# EAGLE design ads-b (EAGLE 7.5.0)
PROJECT_NAME: ADS-B Receiver; REVISION: 0.1

## Sheet 1 of 4
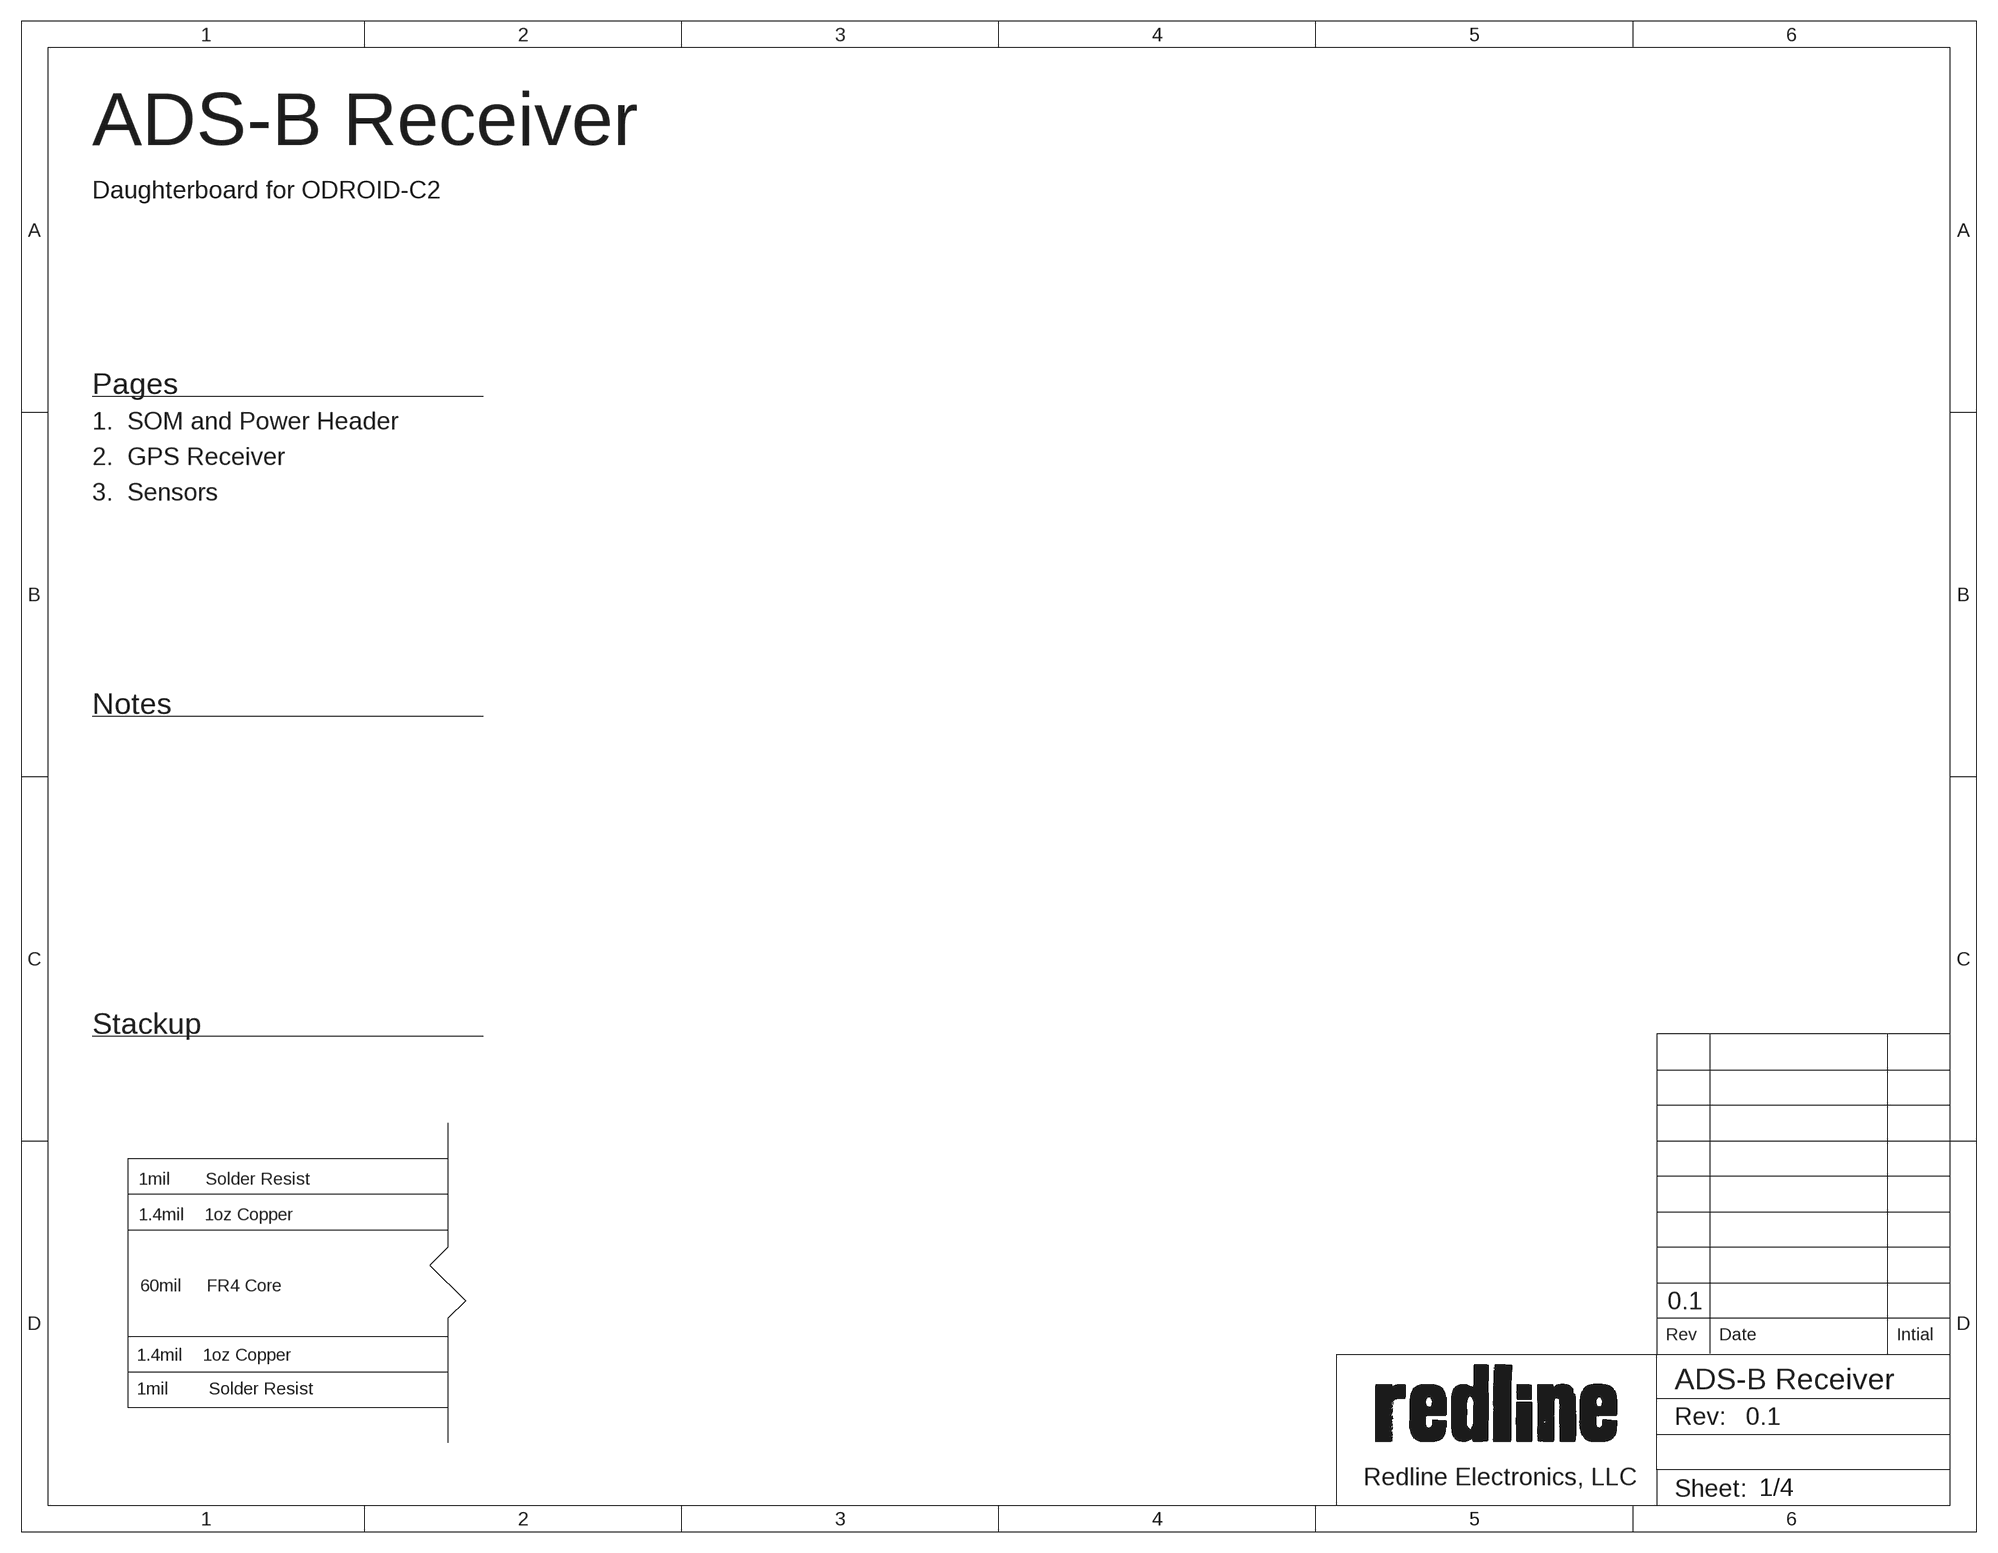
[diagram p0: schematic, sheet 1]

### Notes on the sheet
- ADS-B Receiver
- Daughterboard for ODROID-C2
- Pages
- 1.  SOM and Power Header
- 2.  GPS Receiver
- 3.  Sensors
- Notes
- Stackup
- 1mil       Solder Resist
- 1.4mil    1oz Copper
- 60mil     FR4 Core
- 0.1
- 1.4mil    1oz Copper
- 1mil        Solder Resist

## Sheet 2 of 4
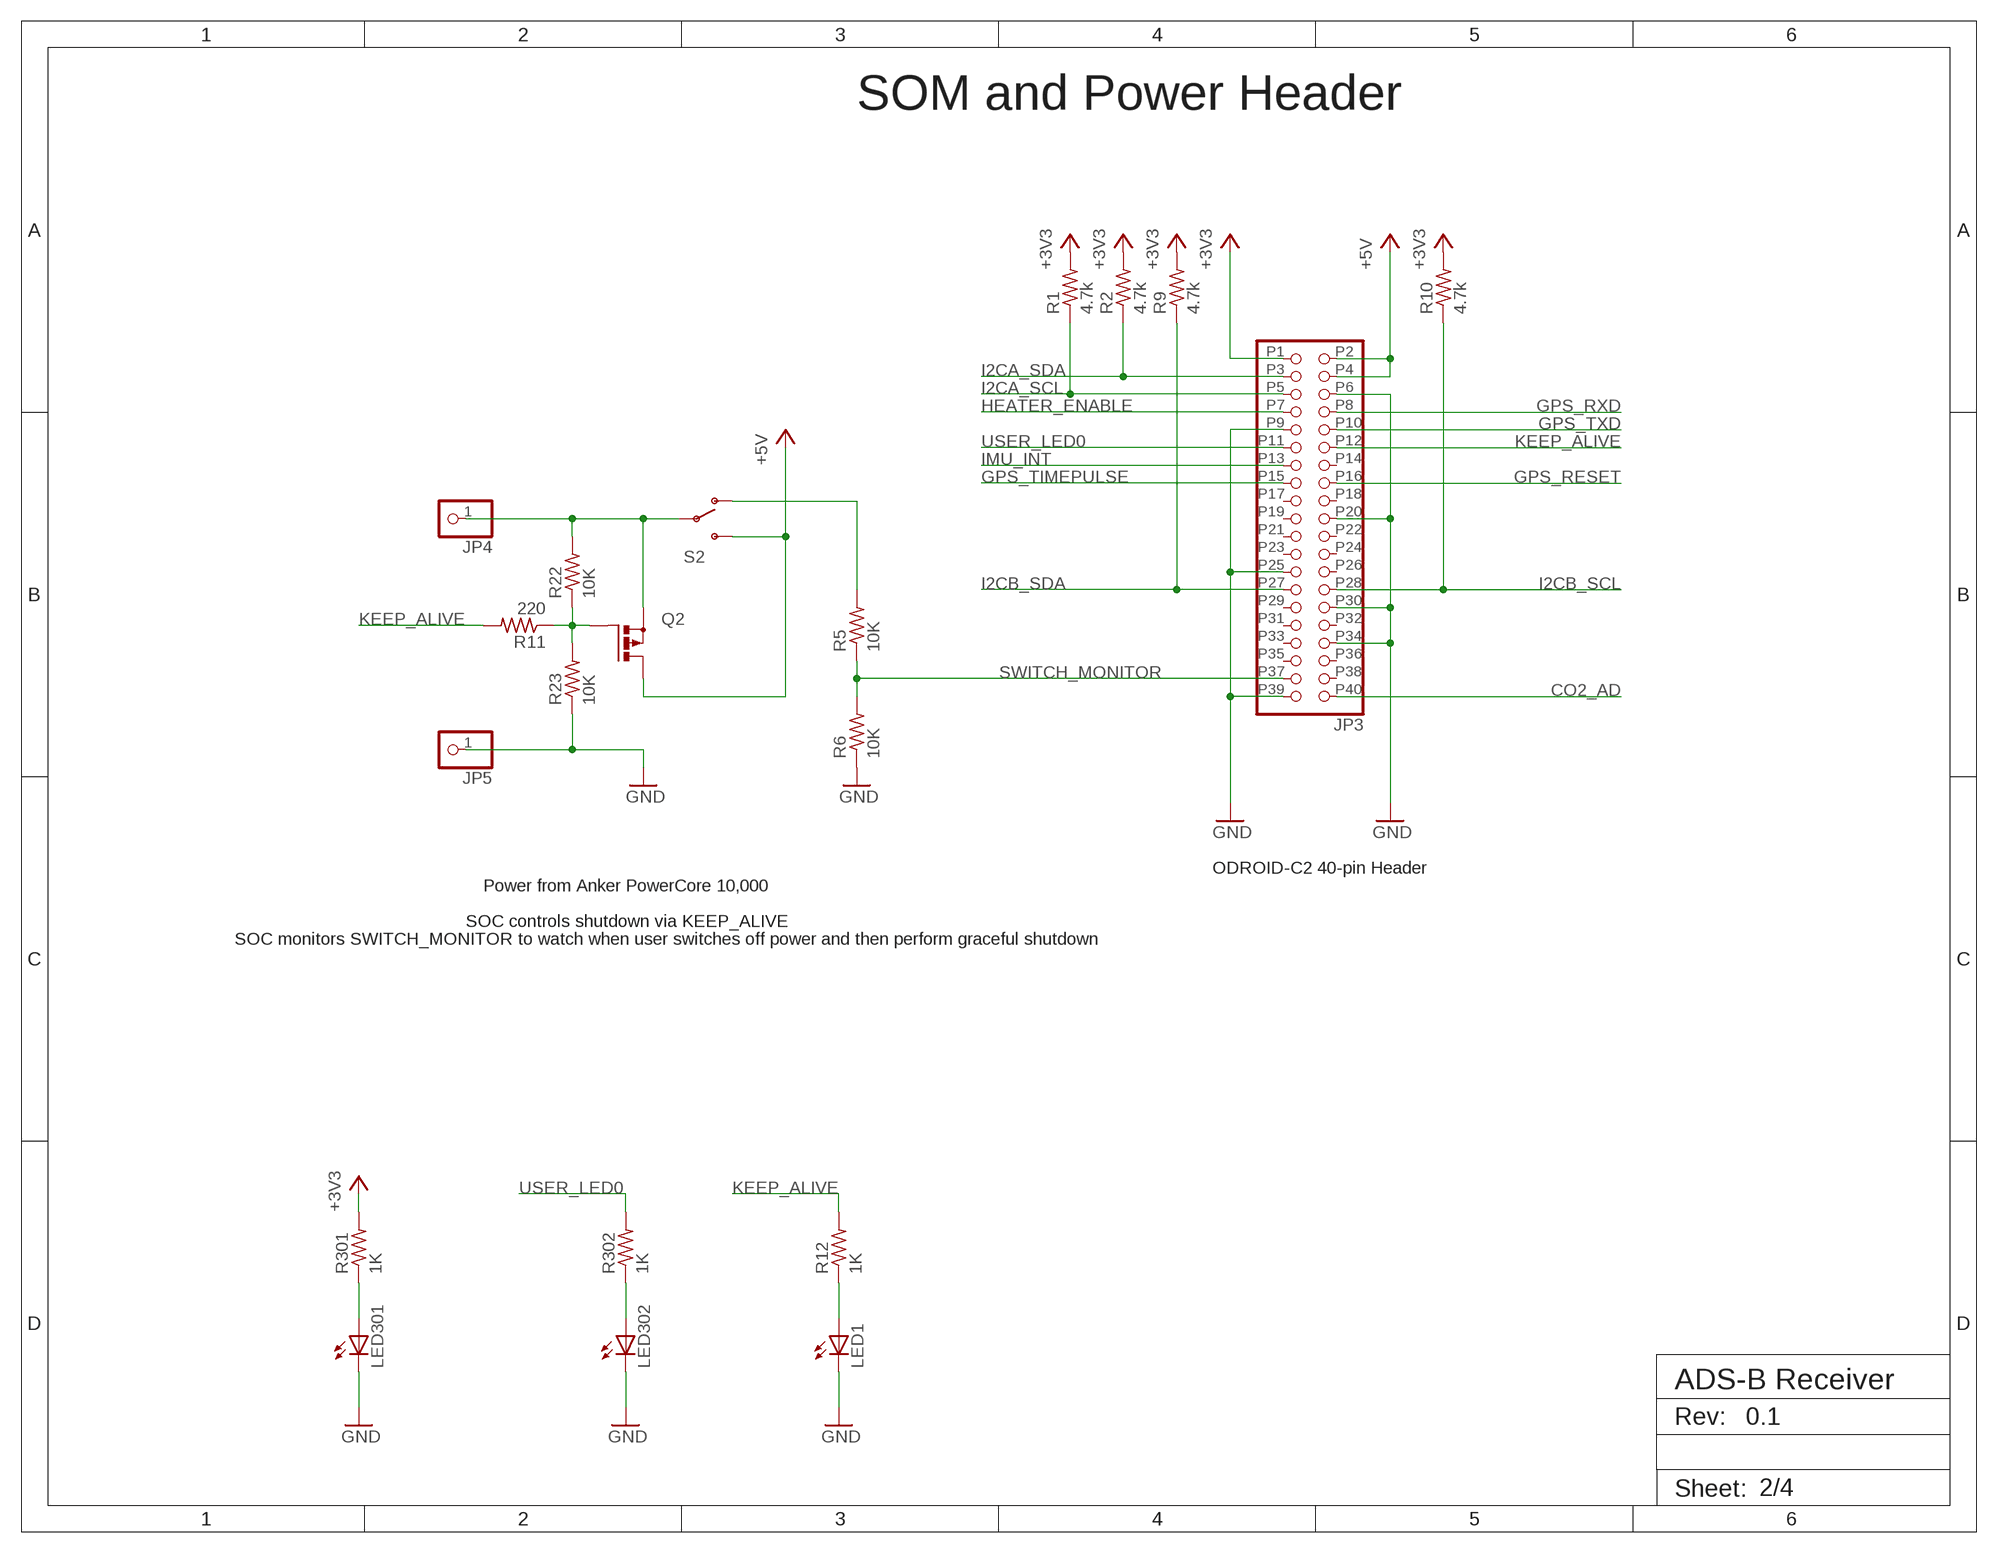
[diagram p1: schematic, sheet 2]

### Parts
JP3  ODROID-C2  [2X20]
JP4  PINHD-1X1  [1X01]
JP5  PINHD-1X1  [1X01]
LED1  LEDSML0603  [SML0603]
LED301  LEDSML0603  [SML0603]
LED302  LEDSML0603  [SML0603]
Q2  P-MOSFET-SO8  [SO-08]
R1  4.7k  R-US_R0603  [R0603]
R2  4.7k  R-US_R0603  [R0603]
R5  10K  R-US_R0603  [R0603]
R6  10K  R-US_R0603  [R0603]
R9  4.7k  R-US_R0603  [R0603]
R10  4.7k  R-US_R0603  [R0603]
R11  220  R-US_R0603  [R0603]
R12  1K  R-US_R0603  [R0603]
R22  10K  R-US_R0603  [R0603]
R23  10K  R-US_R0603  [R0603]
R301  1K  R-US_R0603  [R0603]
R302  1K  R-US_R0603  [R0603]
S2  SWITCH-SPDTSMD2  [SWITCH-SPDT-SMD]

### Nets
+3V3: JP3.P1 R1.2 R2.2 R9.2 R10.2 R301.2 ; also sheet 3,4
+5V: JP3.P2 JP3.P4 Q2.5(D) Q2.6(D) Q2.7(D) Q2.8(D) S2.3(S) ; also sheet 4
CO2_AD: JP3.P40 ; also sheet 4
GND: JP3.P6 JP3.P9 JP3.P20 JP3.P25 JP3.P30 JP3.P34 JP3.P39 JP5.1 LED1.C LED301.C LED302.C R6.1 R23.1 ; also sheet 3,4
GPS_RESET: JP3.P16 ; also sheet 3
GPS_RXD: JP3.P8 ; also sheet 3
GPS_TIMEPULSE: JP3.P15 ; also sheet 3
GPS_TXD: JP3.P10 ; also sheet 3
HEATER_ENABLE: JP3.P7 ; also sheet 4
I2CA_SCL: JP3.P5 R1.1 ; also sheet 4
I2CA_SDA: JP3.P3 R2.1 ; also sheet 4
I2CB_SCL: JP3.P28 R10.1 ; also sheet 4
I2CB_SDA: JP3.P27 R9.1 ; also sheet 4
IMU_INT: JP3.P13 ; also sheet 4
KEEP_ALIVE: JP3.P12 R11.2 R12.2
N$7: JP4.1 Q2.1(S) Q2.2(S) Q2.3(S) R22.2 S2.2(P)
N$9: Q2.4(G) R11.1 R22.1 R23.2
N$10: R5.2 S2.1(O)
SWITCH_MONITOR: JP3.P37 R5.1 R6.2
USER_LED0: JP3.P11 R302.2
VDD_PGOOD1: LED301.A R301.1
VDD_PGOOD2: LED302.A R302.1
VDD_PGOOD3: LED1.A R12.1
Unconnected: JP3.P14 JP3.P17 JP3.P18 JP3.P19 JP3.P21 JP3.P22 JP3.P23 JP3.P24 JP3.P26 JP3.P29 JP3.P31 JP3.P32 JP3.P33 JP3.P35 JP3.P36 JP3.P38

### Notes on the sheet
- SOM and Power Header
- ODROID-C2 40-pin Header
- Power from Anker PowerCore 10,000
- SOC controls shutdown via KEEP_ALIVE
- SOC monitors SWITCH_MONITOR to watch when user switches off power and then perform graceful shutdown

## Sheet 3 of 4
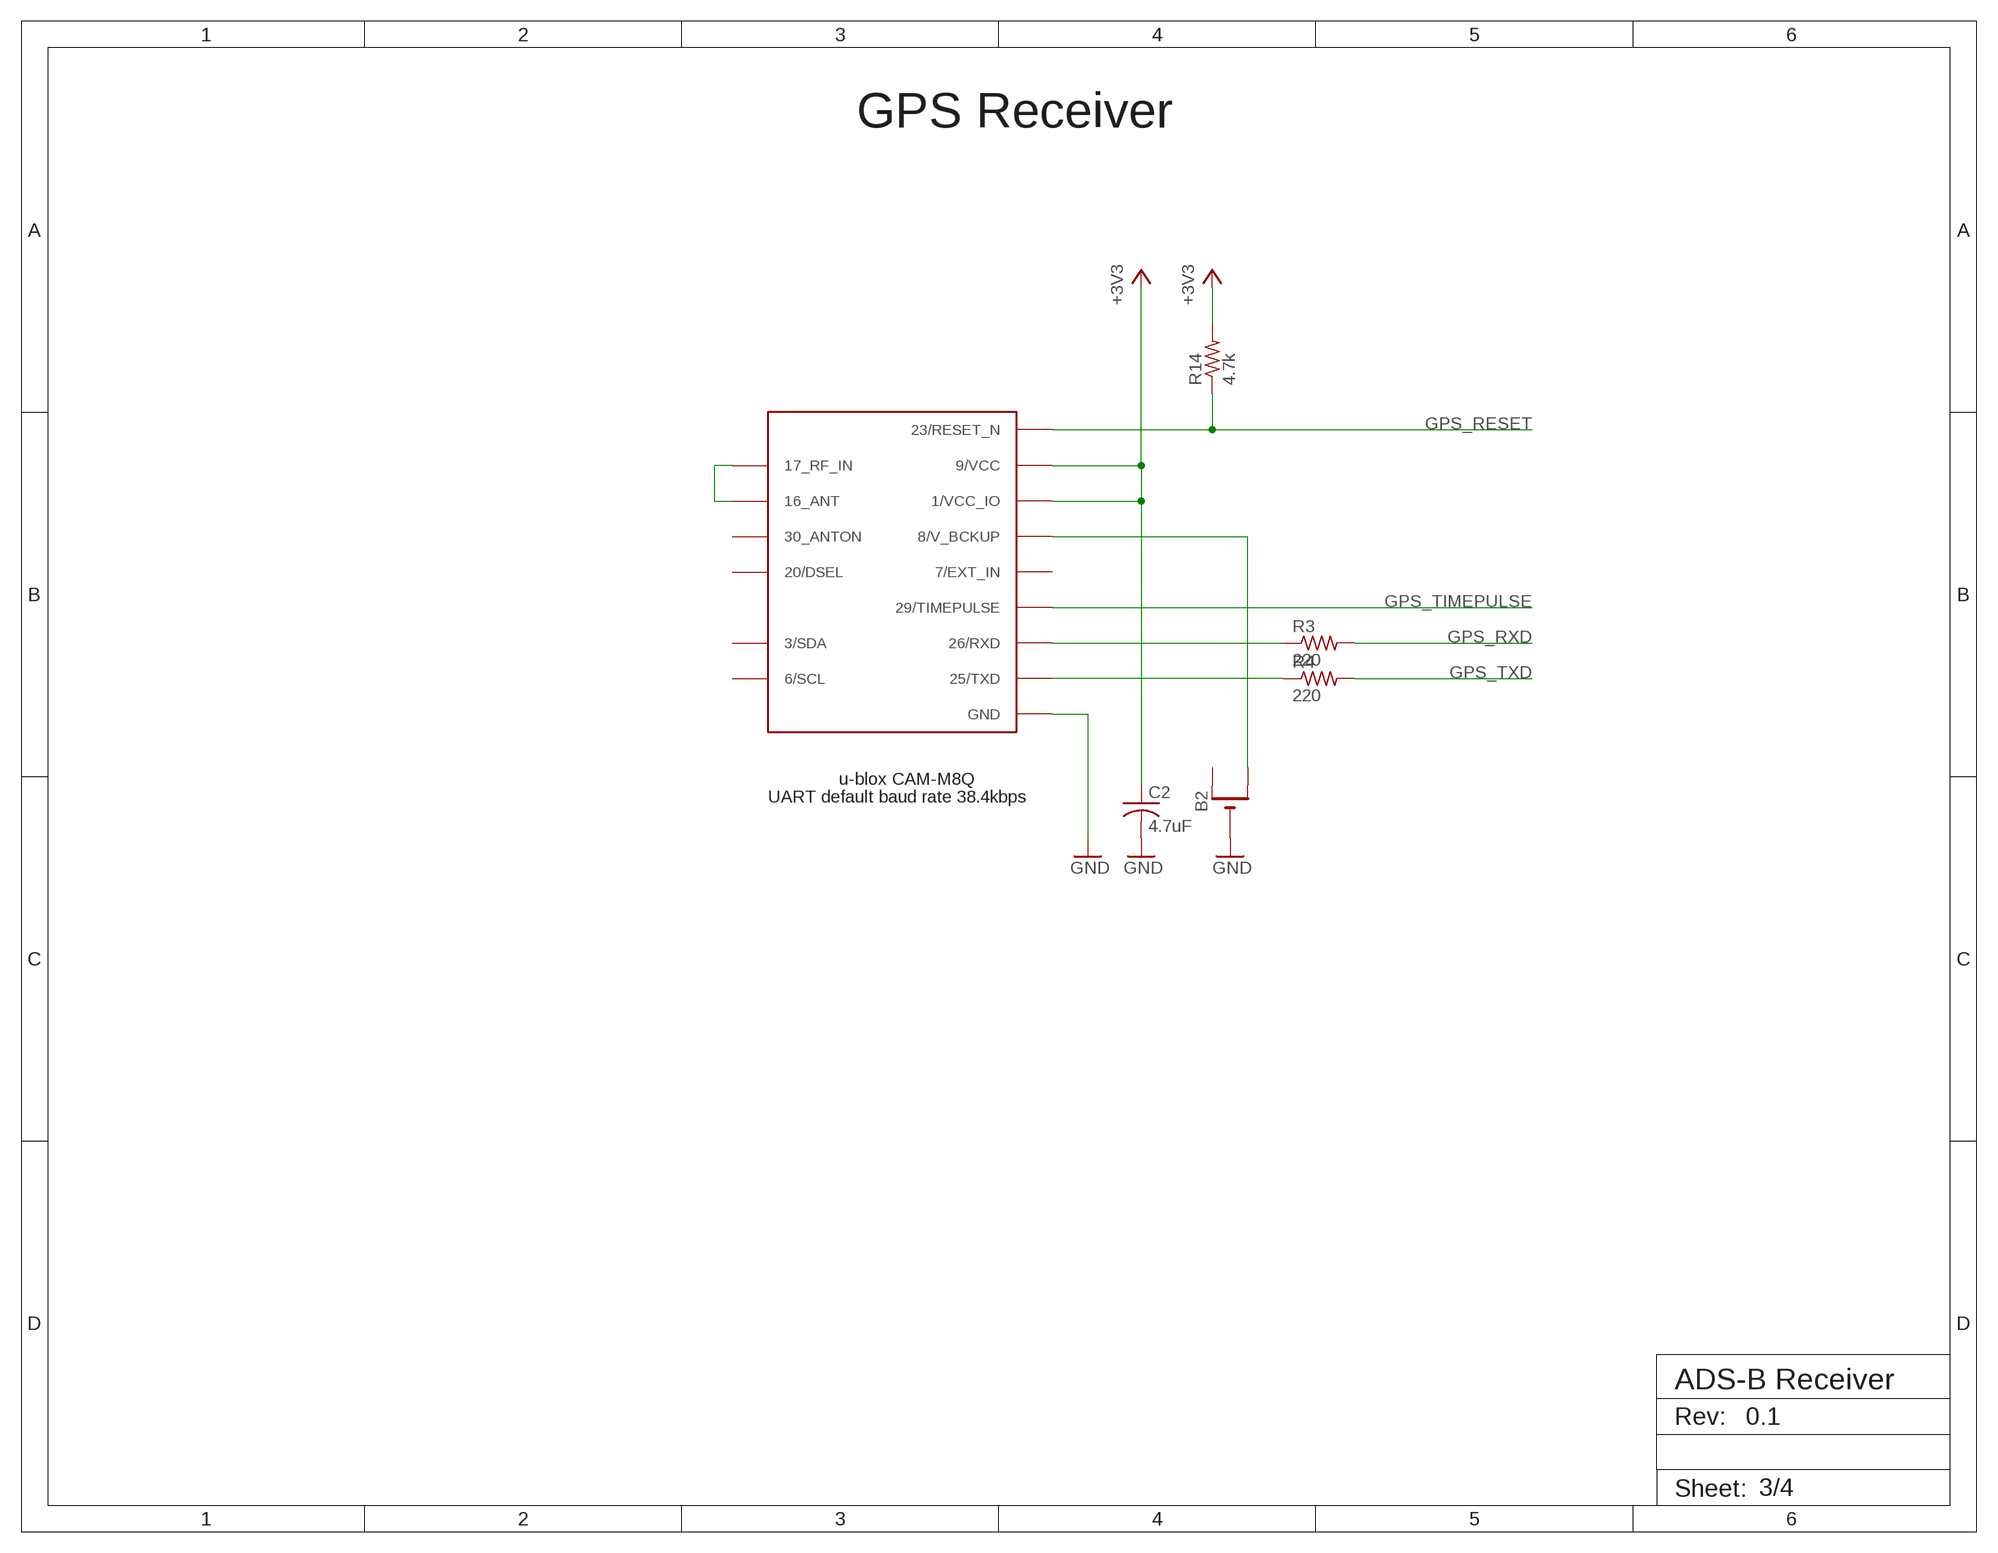
[diagram p2: schematic, sheet 3]

### Parts
B2  CR1220THM  [CR1220-THM]
C2  4.7uF  C-USC0603  [C0603]
R3  220  R-US_R0603  [R0603]
R4  220  R-US_R0603  [R0603]
R14  4.7k  R-US_R0603  [R0603]
U$2  UBLOX_CAM  [UBLOX_CAM]

### Nets
+3V3: C2.1 R14.2 U$2.1/VCC_IO U$2.9/VCC ; also sheet 2,4
GND: B2.- C2.2 U$2.4/GND(GND) U$2.5/GND(GND) U$2.10/GND(GND) U$2.11/GND(GND) U$2.12/GND(GND) U$2.13/GND(GND) U$2.14/GND(GND) U$2.15/GND(GND) U$2.18/GND(GND) U$2.19/GND(GND) U$2.21/GND(GND) U$2.22/GND(GND) U$2.27/GND(GND) U$2.31/GND(GND) ; also sheet 2,4
GPS_RESET: R14.1 U$2.23/RESET_N ; also sheet 2
GPS_RXD: R3.2 ; also sheet 2
GPS_TIMEPULSE: U$2.29/TIMEPULSE ; also sheet 2
GPS_TXD: R4.2 ; also sheet 2
N$2: B2.+2(+1) U$2.8/V_BCKP(8/V_BCKUP)
N$3: R3.1 U$2.26/RXD
N$4: R4.1 U$2.25/TXD
N$6: U$2.16/ANT(16_ANT) U$2.17/RF_IN(17_RF_IN)
Unconnected: B2.+1(+) U$2.3/SDA U$2.6/SCL U$2.7/EXINT(7/EXT_IN) U$2.20/DSEL U$2.30/ANTON(30_ANTON)

### Notes on the sheet
- GPS Receiver
- u-blox CAM-M8Q
- UART default baud rate 38.4kbps

## Sheet 4 of 4
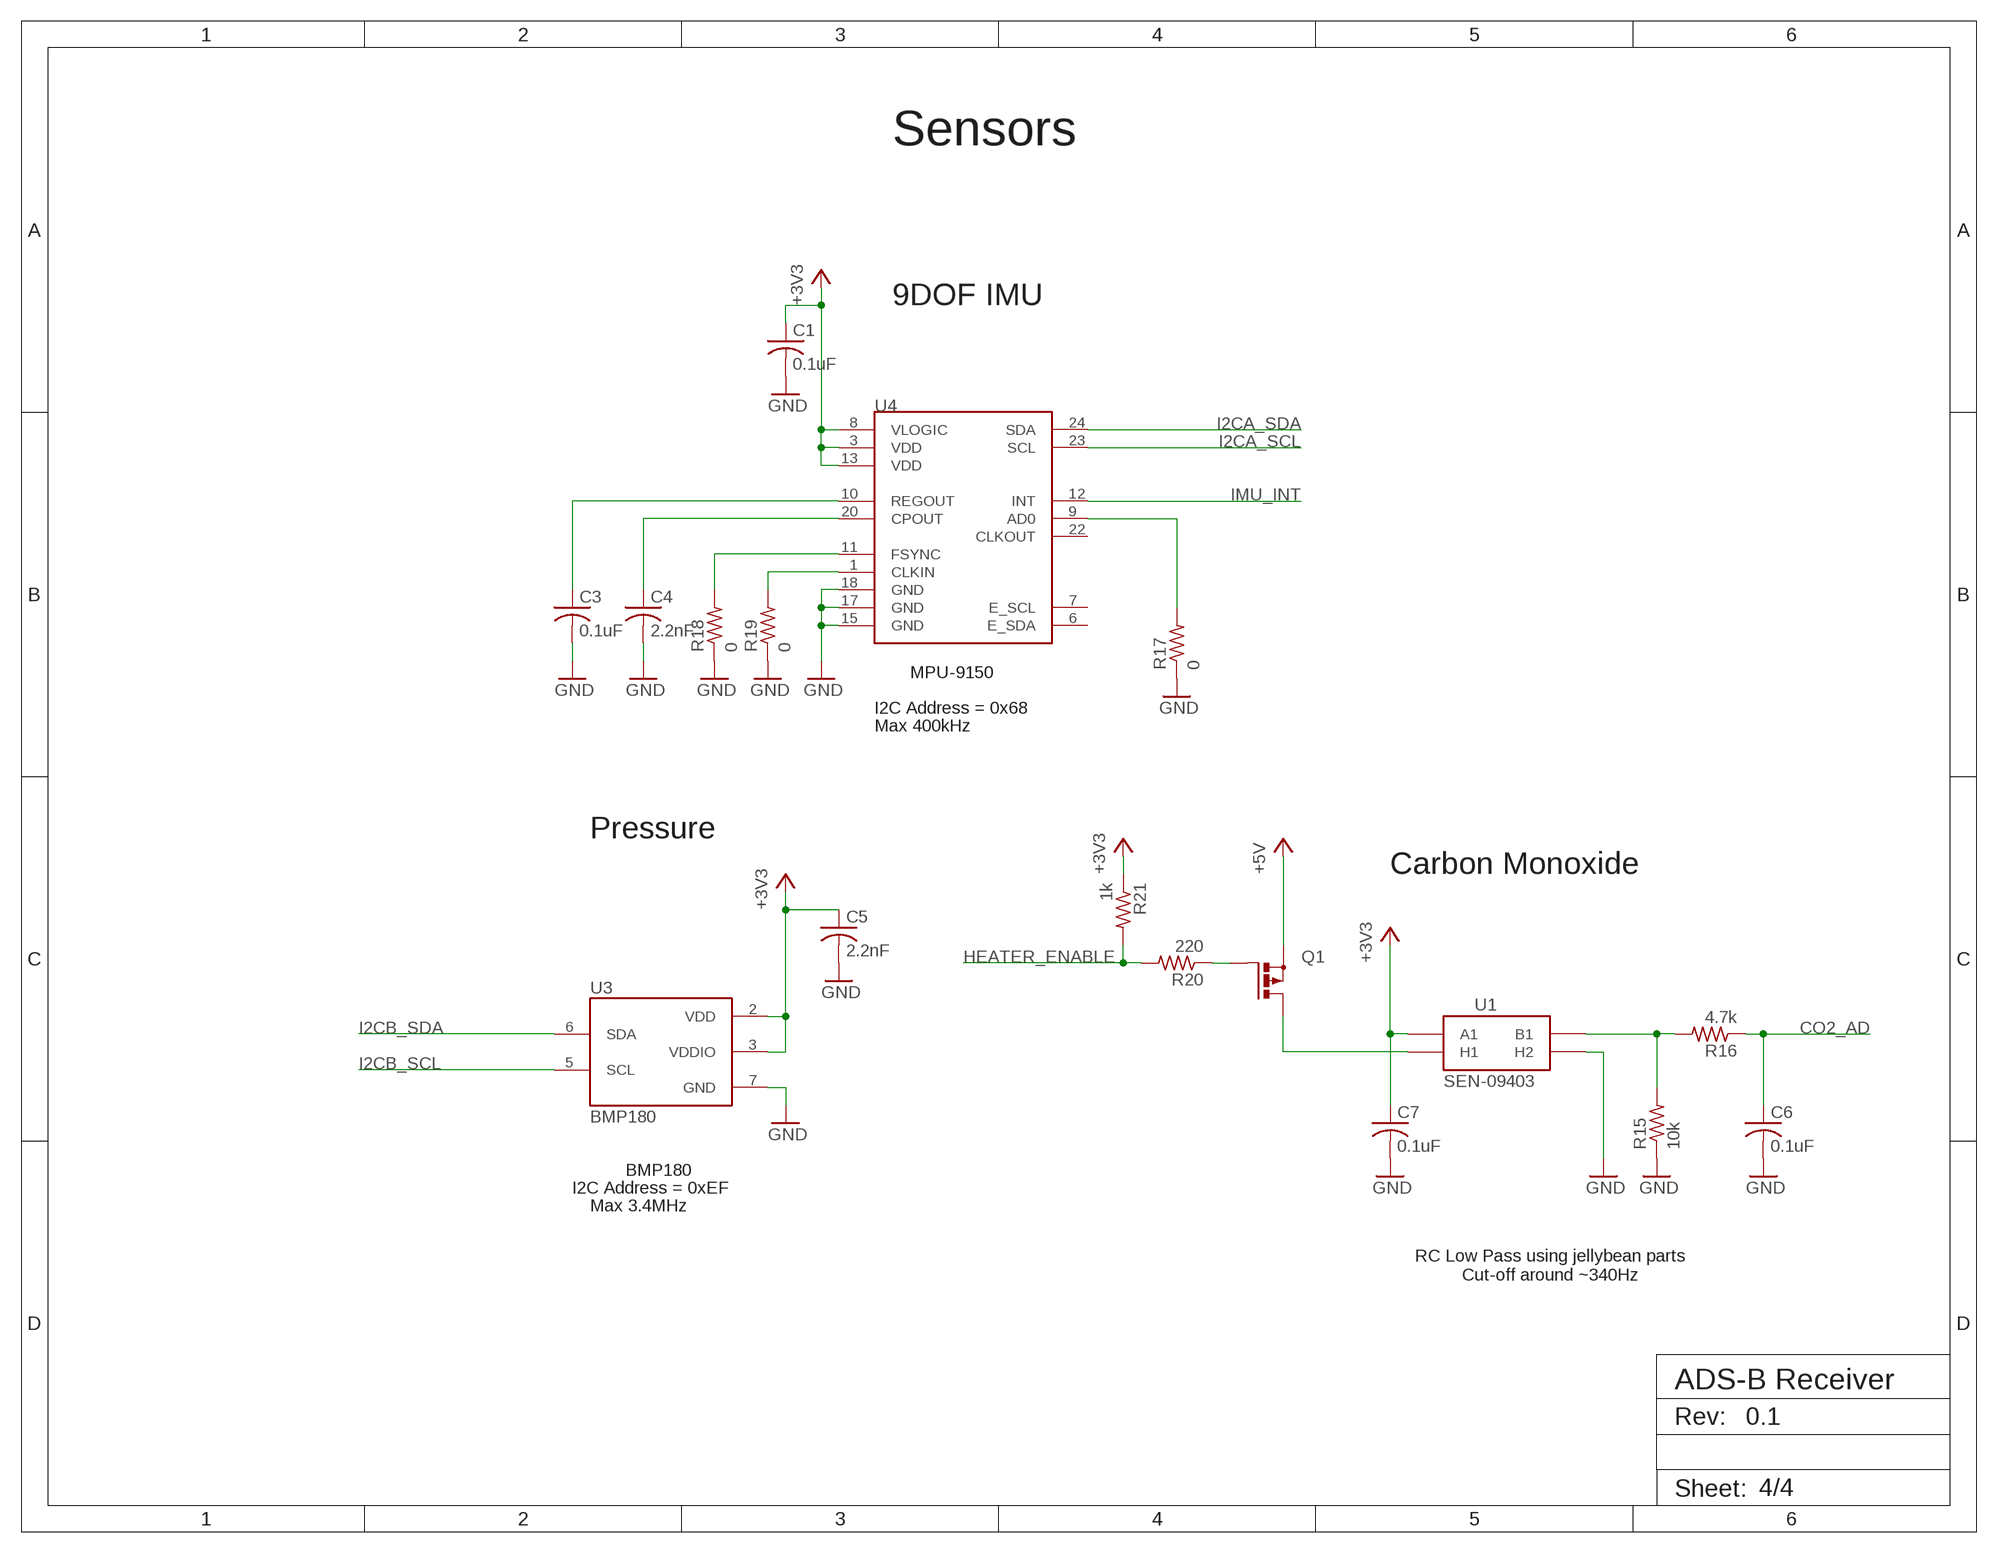
[diagram p3: schematic, sheet 4]

### Parts
C1  0.1uF  C-USC0603  [C0603]
C3  0.1uF  C-USC0603  [C0603]
C4  2.2nF  C-USC0603  [C0603]
C5  2.2nF  C-USC0603  [C0603]
C6  0.1uF  C-USC0603  [C0603]
C7  0.1uF  C-USC0603  [C0603]
Q1  P-MOSFET-SO8  [SO-08]
R15  10k  R-US_R0603  [R0603]
R16  4.7k  R-US_R0603  [R0603]
R17  0  R-US_R0603  [R0603]
R18  0  R-US_R0603  [R0603]
R19  0  R-US_R0603  [R0603]
R20  220  R-US_R0603  [R0603]
R21  1k  R-US_R0603  [R0603]
U1  SEN-09403  GAS_SENSOR  [MQ-3]
U3  BMP180  [BMP180]
U4  MPU-9150QFN-24-NP  [QFN-24-NP]

### Nets
+3V3: C1.1 C5.1 C7.1 R21.1 U1.A1 U3.2(VDD) U3.3(VDDIO) U4.3(VDD) U4.8(VLOGIC) U4.13(VDD) ; also sheet 2,3
+5V: Q1.1(S) Q1.2(S) Q1.3(S) ; also sheet 2
CO2_AD: C6.1 R16.1 ; also sheet 2
GND: C1.2 C3.2 C4.2 C5.2 C6.2 C7.2 R15.1 R17.1 R18.1 R19.1 U1.HB(H2) U3.7(GND) U4.15(GND) U4.17(GND) U4.18(GND) ; also sheet 2,3
HEATER_ENABLE: R20.2 R21.2 ; also sheet 2
I2CA_SCL: U4.23(SCL) ; also sheet 2
I2CA_SDA: U4.24(SDA) ; also sheet 2
I2CB_SCL: U3.5(SCL) ; also sheet 2
I2CB_SDA: U3.6(SDA) ; also sheet 2
IMU_INT: U4.12(INT) ; also sheet 2
N$1: C3.1 U4.10(REGOUT)
N$5: R15.2 R16.2 U1.B1
N$8: C4.1 U4.20(CPOUT)
N$11: R17.2 U4.9(AD0)
N$12: R18.2 U4.11(FSYNC)
N$13: R19.2 U4.1(CLKIN)
N$14: Q1.5(D) Q1.6(D) Q1.7(D) Q1.8(D) U1.HA(H1)
N$16: Q1.4(G) R20.1
Unconnected: U4.6(E_SDA) U4.7(E_SCL) U4.22(CLKOUT)

### Notes on the sheet
- Sensors
- 9DOF IMU
- MPU-9150
- I2C Address = 0x68
- Max 400kHz
- Pressure
- Carbon Monoxide
- BMP180
- I2C Address = 0xEF
- Max 3.4MHz
- RC Low Pass using jellybean parts
  Cut-off around ~340Hz

## Library data of the parts
B2 = adafruit:CR1220: CR1216/CR1220/CR1225 12mm 3V lithium coin cell Great for battery packup. Both SMT and THM holders. Note the THM package has the ground pads on both sides of the PCB so that the masks are the same - this reduces the cost
C1-C7 = rcl:C-US: CAPACITOR, American symbol
JP3 = connectors:ODROID-C2: PIN HEADER
JP4 JP5 = adafruit:PINHD-1X1: Pin header 1x1 for 0.1" spacing With round pins
LED1 LED301 LED302 = led:LED: LED OSRAM: - CHIPLED LG R971, LG N971, LY N971, LG Q971, LY Q971, LO R971, LY R971 LH N974, LH R974 LS Q976, LO Q976, LY Q976 LO Q996 - Hyper CHIPLED LW Q18S LB Q993, LB Q99A, LB R99A - SideLED LS A670, LO A670, LY A670, LG A670, LP A670 LB A673, LV A673, LT A673, LW A673 LH A674 LY A675 LS A676, LA A676, LO A676, LY A676, LW A676 LS A679, LY A679, LG A679 - Hyper Micro SIDELED® LS Y876, LA Y876, LO Y876, LY Y876 LT Y87S - SmartLED LW L88C, LW L88S LB L89C, LB L89S, LG L890 LS L89K, LO L89K, LY L89K LS L896, LA L896, LO L896, LY L896 - TOPLED LS T670, LO T670, LY T670, LG T670, LP T670 LSG T670, LSP T670, LSY T670, LOP T670, LYG T670 LG T671, LOG T671, LSG T671 LB T673, LV T673, LT T673, LW T673 LH T674 LS T676, LA T676, LO T676, LY T676, LB T676, LH T676, LSB T676, LW T676 LB T67C, LV T67C, LT T67C, LS T67K, LO T67K, LY T67K, LW E67C LS E67B, LA E67B, LO E67B, LY E67B, LB E67C, LV E67C, LT E67C LW T67C LS T679, LY T679, LG T679 LS T770, LO T770, LY T770, LG T770, LP T770 LB T773, LV T773, LT T773, LW T773 LH T774 LS E675, LA E675, LY E675, LS T675 LS T776, LA T776, LO T776, LY T776, LB T776 LHGB T686 LT T68C, LB T68C - Hyper Mini TOPLED® LB M676 - Mini TOPLED Santana® LG M470 LS M47K, LO M47K, LY M47K Source: http://www.osram.convergy.de LUXEON: - LUMILED® LXK2-PW12-R00, LXK2-PW12-S00, LXK2-PW14-U00, LXK2-PW14-V00 LXK2-PM12-R00, LXK2-PM12-S00, LXK2-PM14-U00 LXK2-PE12-Q00, LXK2-PE12-R00, LXK2-PE12-S00, LXK2-PE14-T00, LXK2-PE14-U00 LXK2-PB12-K00, LXK2-PB12-L00, LXK2-PB12-M00, LXK2-PB14-N00, LXK2-PB14-P00, LXK2-PB14-Q00 LXK2-PR12-L00, LXK2-PR12-M00, LXK2-PR14-Q00, LXK2-PR14-R00 LXK2-PD12-Q00, LXK2-PD12-R00, LXK2-PD12-S00 LXK2-PH12-R00, LXK2-PH12-S00 LXK2-PL12-P00, LXK2-PL12-Q00, LXK2-PL12-R00 Source: www.luxeon.com KINGBRIGHT: KA-3528ASYC Source: www.kingbright.com
Q1 Q2 = transistor-power:P-MOSFET-SO8: P-Channel MOSFET Example: FDS4435A; P-Channel Logic Level PowerTrench® MOSFET FDS4465; P-Channel 1.8V Specified PowerTrench® MOSFET Source: www.fairchildsemi.com
R1-R6 R9-R12 R14-R23 R301 R302 = rcl:R-US_: RESISTOR, American symbol
S2 = SparkFun-Electromechanical:SWITCH-SPDT: SPDT Switch Simple slide switch, Spark Fun Electronics SKU : COM-00102 DPDT SMT slide switch, AYZ0202, SWCH-08179
U1 = SparkFun-Sensors:GAS_SENSOR: MQ-3 alcohol gas sensor . FP not tested. SEN-08880.
U3 = SparkFun-Sensors:BMP180: BOSCH BMP180 DIGITAL BAROMETRIC PRESSURE SENSOR Web page: http://www.bosch-sensortec.com/en/homepage/products_3/environmental_sensors_1/bmp180_1/bmp180 Datasheet: http://ae-bst.resource.bosch.com/media/products/dokumente/bmp180/BST-BMP180-DS000-09.pdf The BMP180 is the function compatible successor of the BMP085, a new generation of high precision digital pressure sensors for consumer applications. The ultra-low power, low voltage electronics of the BMP180 is optimized for use in mobile phones, PDAs, GPS navigation devices and outdoor equipment. With a low altitude noise of merely 0.25m at fast conversion time, the BMP180 offers superior performance. The I2C interface allows for easy system integration with a microcontroller. The BMP180 is based on piezo-resistive technology for EMC robustness, high accuracy and linearity as well as long term stability. Key features: - Temperature measurement included - I2C interface - Fully calibrated - Pb-free, halogen-free and RoHS compliant, - MSL 1 Basic specs: Pressure range: 300 to 1100hPa (+9000m to -500m relating to sea level) Supply voltage: 1.8 to 3.6V (VDD), 1.62V to 3.6V (VDDIO) Package: LGA package with metal lid Small footprint: 3.6mm x 3.8mm Super-flat: 0.93mm height Low power: 5μA at 1 sample / sec. in standard mode Low noise: 0.06hPa (0.5m) in ultra low power mode, 0.02hPa (0.17m) advanced resolution mode Typical applications: - Enhancement of GPS navigation (dead-reckoning, slope detection, etc.) - In- and out-door navigation - Leisure and sports - Weather forecast - Vertical velocity indication (rise/sink speed)
U4 = SparkFun-Sensors:MPU-9150: 9DOF (3mag, 3accel, 3rotat). I2C interface.
U$2 = ubloxLib:UBLOX_CAM: u-blox CAM GNSS antenna module

## Board
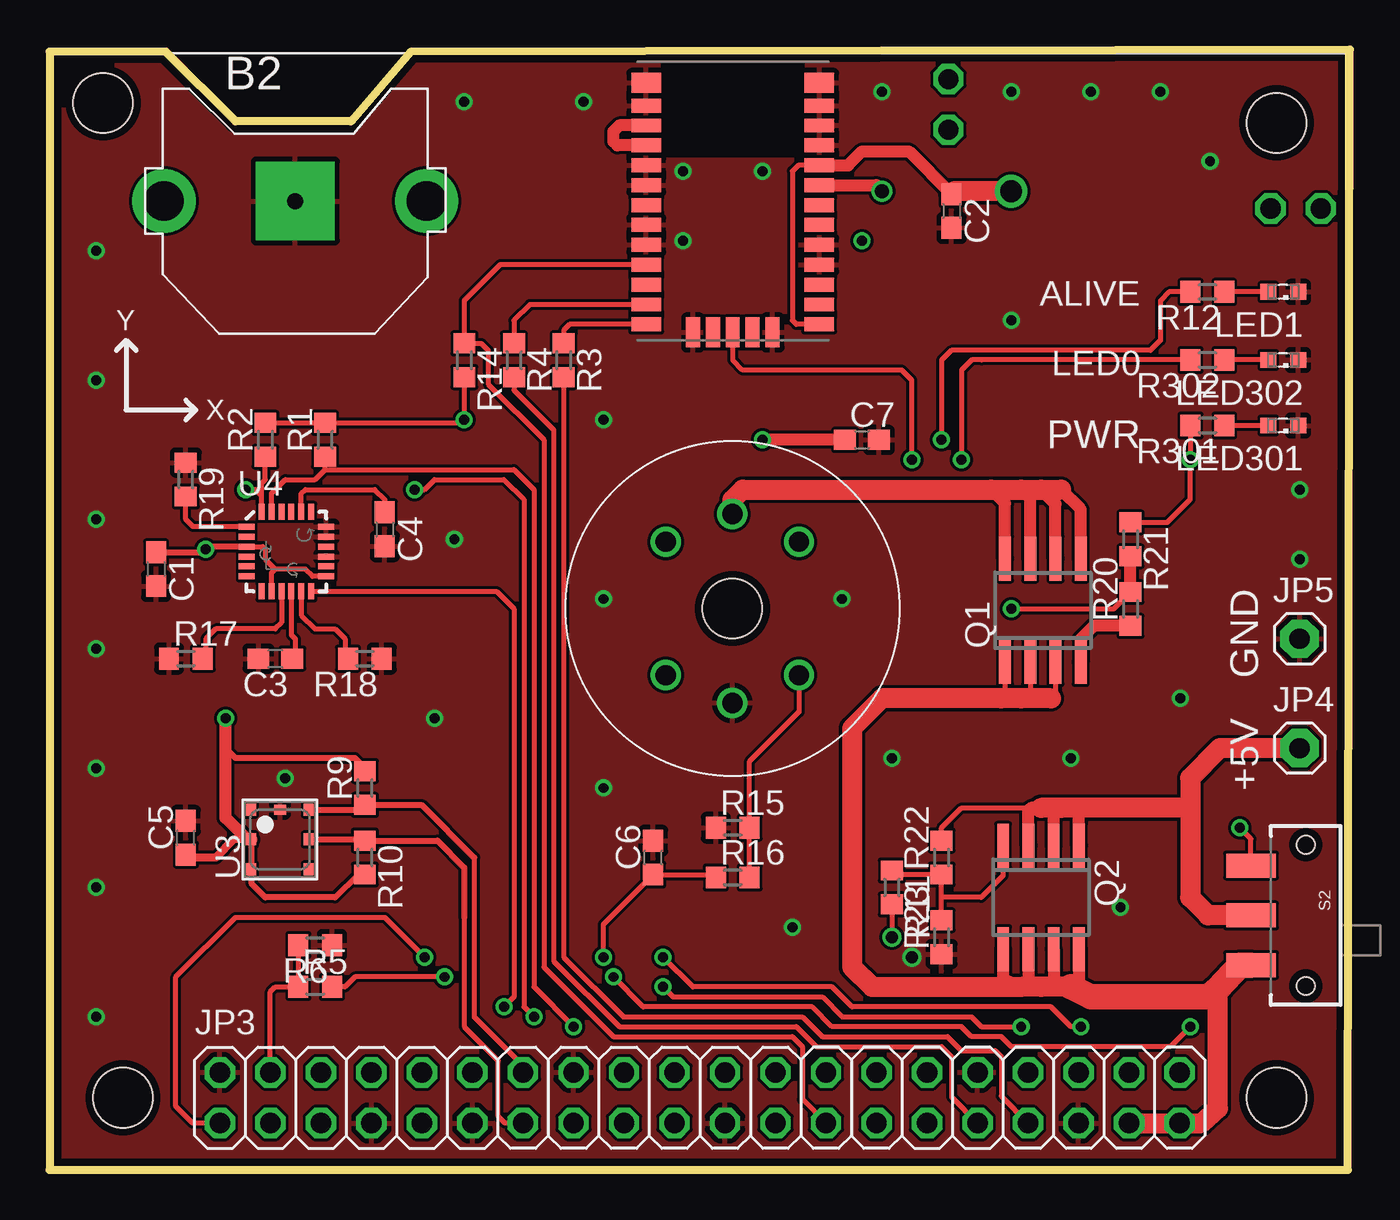
[diagram p4: board, top side]
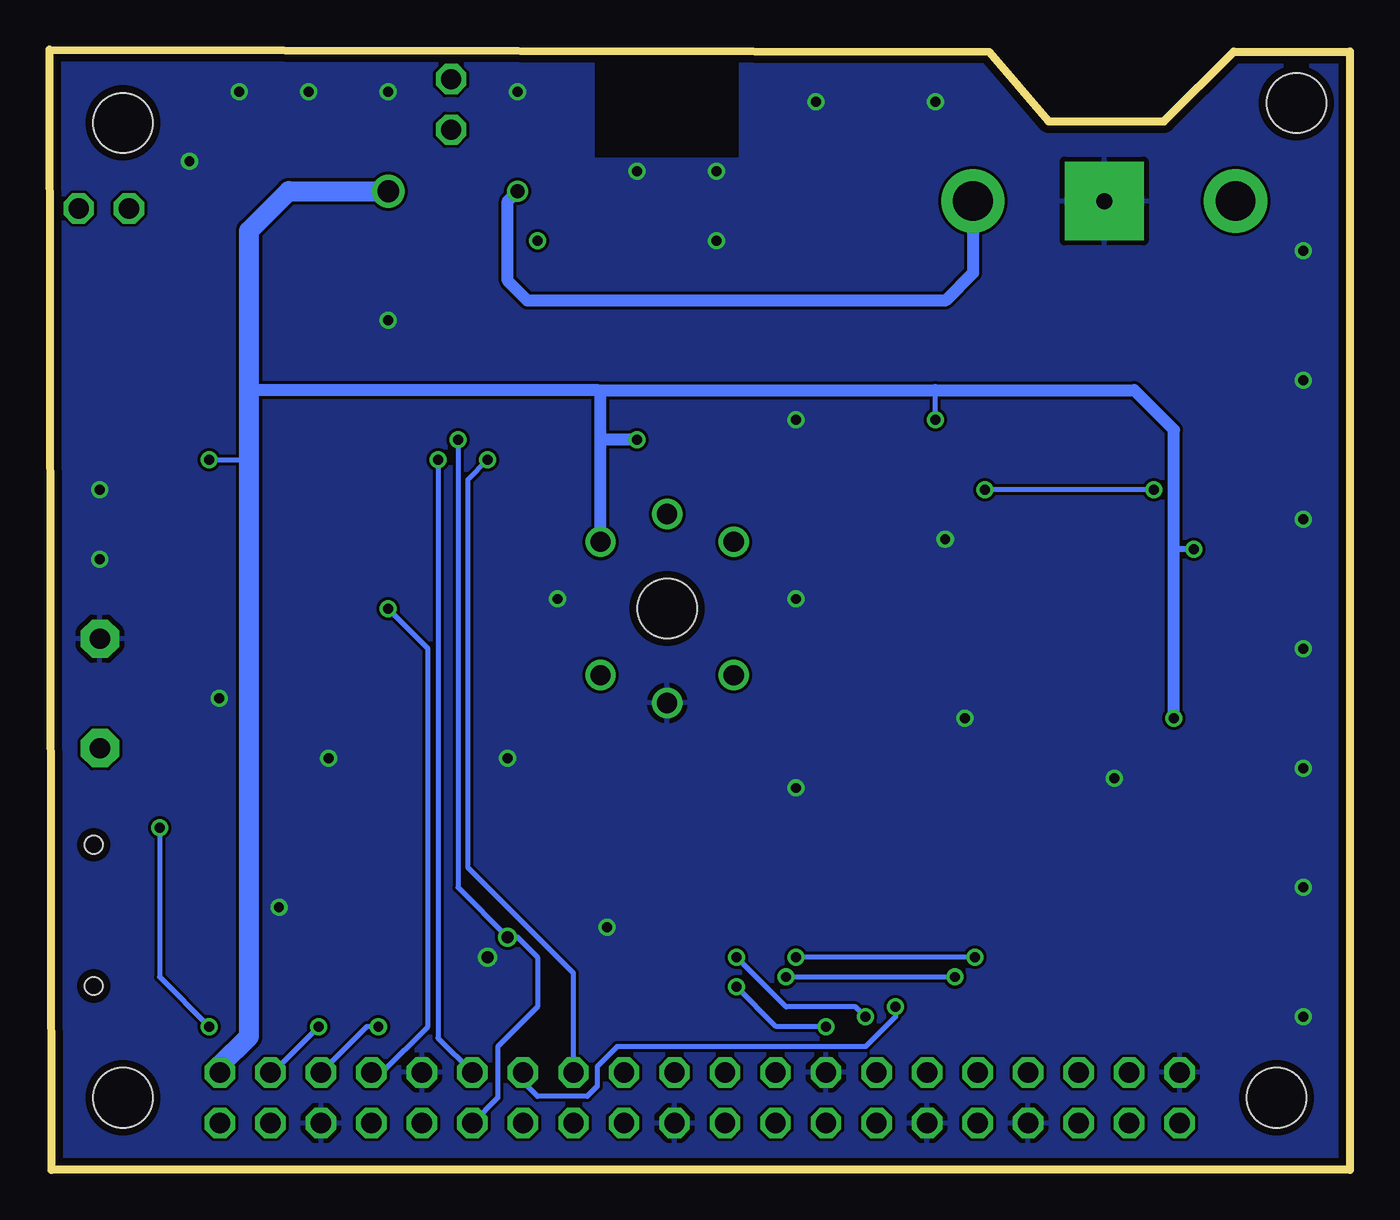
[diagram p5: board, bottom side, seen from below]

Size 65.37 x 56.31 mm. Coordinates in mm from the lower left corner, seen from the top.
Outline: 0,56.21 0,0 65.27,0 65.37,56.31 18.14,56.2 15.14,52.7 9.34,52.7 5.84,56.21 0,56.21
Copper layers (1*16): Top 0.0356mm / dielectric 1.5011mm / Bottom 0.0356mm
Design rules "LaenPCBOrder": minimum track width 6mil, minimum drill 13mil, track to track 6mil, track to pad 6mil, pad to pad 6mil, via to via 6mil, smd to smd 6mil, copper to edge 15mil, drill to drill 6mil, minimum pad ring 7mil, minimum via ring 7mil, stop-mask expansion 3mil, vias tented up to drill 0mil, thermal gap 10mil

### Footprints (pad centres in the part's own frame; a part is rotated, then mirrored left to right if it is on the bottom)
CR1220-THM = drill 2 pad 3.175: +1 -6.604,0; +2 6.604,0 | drill 0.8 pad 3.962 square: - 0,0
C0603 = smd 1.1 x 1: 1 -0.85,0; 2 0.85,0
2X20 = drill 1.016 octagon: OTG_EN1 12.5,51.2; OTG_EN2 12.5,48.66; P1 24.13,1.27; P2 24.13,-1.27; P3 21.59,1.27; P4 21.59,-1.27; P5 19.05,1.27; P6 19.05,-1.27; P7 16.51,1.27; P8 16.51,-1.27; P9 13.97,1.27; P10 13.97,-1.27; P11 11.43,1.27; P12 11.43,-1.27; P13 8.89,1.27; P14 8.89,-1.27; P15 6.35,1.27; P16 6.35,-1.27; P17 3.81,1.27; P18 3.81,-1.27; P19 1.27,1.27; P20 1.27,-1.27; P21 -1.27,1.27; P22 -1.27,-1.27; P23 -3.81,1.27; P24 -3.81,-1.27; P25 -6.35,1.27; P26 -6.35,-1.27; P27 -8.89,1.27; P28 -8.89,-1.27; P29 -11.43,1.27; P30 -11.43,-1.27; P31 -13.97,1.27; P32 -13.97,-1.27; P33 -16.51,1.27; P34 -16.51,-1.27; P35 -19.05,1.27; P36 -19.05,-1.27; P37 -21.59,1.27; P38 -21.59,-1.27; P39 -24.13,1.27; P40 -24.13,-1.27; PWR_SW1 31.23,44.7; PWR_SW2 28.7,44.7 | hole 3: 29,0; 29,0; -29,0; -30,50; 29,49
1X01 = drill 1.016 pad 1.93 octagon: 1 0,0
SML0603 = smd 0.8 x 0.8: A 0.75,0; C -0.75,0
SO-08 = smd 0.6 x 2.2: 1 -1.905,-2.6; 2 -0.635,-2.6; 3 0.635,-2.6; 4 1.905,-2.6; 5 1.905,2.6; 6 0.635,2.6; 7 -0.635,2.6; 8 -1.905,2.6
R0603 = smd 1 x 1.1: 1 -0.85,0; 2 0.85,0
SWITCH-SPDT-SMD = smd 1.2 x 2.5: 1 -2.5,-2.75; 2 0,-2.75; 3 2.5,-2.75 | hole 0.9: -3.55,0; 3.55,0
MQ-3 = drill 1.016: A1 -3.35,3.35; A2 -3.35,-3.35; B1 3.35,3.35; B2 3.35,-3.35; HA -4.75,0; HB 4.75,0 | hole 3: 0,0
BMP180 = smd 0.6 x 0.5: 1 1.5,1.45; 2 0,1.45; 3 -1.5,1.45; 4 -1.5,-1.45; 5 0,-1.45; 6 1.5,-1.45 | smd 0.5 x 0.6: 7 1.5,0
QFN-24-NP = smd 0.8 x 0.3: 1 -2,1.25; 2 -2,0.75; 3 -2,0.25; 4 -2,-0.25; 5 -2,-0.75; 6 -2,-1.25; 13 2,-1.25; 14 2,-0.75; 15 2,-0.25; 16 2,0.25; 17 2,0.75; 18 2,1.25 | smd 0.3 x 0.8: 7 -1.25,-2; 8 -0.75,-2; 9 -0.25,-2; 10 0.25,-2; 11 0.75,-2; 12 1.25,-2; 19 1.25,2; 20 0.75,2; 21 0.25,2; 22 -0.25,2; 23 -0.75,2; 24 -1.25,2
UBLOX_CAM = smd 0.7 x 1.5: 1/VCC_IO -13.2,-4.35; 2/RES -12.2,-4.35; 3/SDA -11.2,-4.35; 4/GND -10.2,-4.35; 5/GND -9.2,-4.35; 6/SCL -8.2,-4.35; 7/EXINT -7.2,-4.35; 8/V_BCKP -6.2,-4.35; 9/VCC -5.2,-4.35; 10/GND -4.2,-4.35; 11/GND -3.2,-4.35; 12/GND -2.2,-4.35; 15/GND -2.2,4.35; 16/ANT -3.2,4.35; 17/RF_IN -4.2,4.35; 18/GND -5.2,4.35; 19/GND -6.2,4.35; 20/DSEL -7.2,4.35; 21/GND -8.2,4.35; 22/GND -9.2,4.35; 23/RESET_N -10.2,4.35; 24/RES -11.2,4.35; 25/TXD -12.2,4.35; 26/RXD -13.2,4.35 | smd 1 x 1.5: 13/GND -1.05,-4.35; 14/GND -1.05,4.35 | smd 1.5 x 0.7: 27/GND -13.6,2; 28/RES -13.6,1; 29/TIMEPULSE -13.6,0; 30/ANTON -13.6,-1; 31/GND -13.6,-2

### Placement (x,y rotation side)
B2  12.34,48.7 0 top
C1  5.34,30.2 270 top
C2  45.34,48.2 270 top
C3  11.34,25.7 180 top
C4  16.84,32.2 270 top
C5  6.84,16.7 90 top
C6  30.34,15.7 90 top
C7  40.84,36.7 0 top
JP3  32.69,3.63 0 top
JP4  62.84,21.2 0 top
JP5  62.84,26.7 0 top
LED1  62.02,44.13 180 top
LED301  62.02,37.42 180 top
LED302  62.02,40.71 180 top
Q1  49.94,28.13 0 top
Q2  49.84,13.7 180 top
R1  13.84,36.7 90 top
R2  10.84,36.7 90 top
R3  25.84,40.7 270 top
R4  23.34,40.7 270 top
R5  13.34,9.2 0 top
R6  13.34,11.3 180 top
R9  15.84,19.2 90 top
R10  15.84,15.7 270 top
R11  42.34,14.2 270 top
R12  58.21,44.13 180 top
R14  20.84,40.7 270 top
R15  34.34,17.2 0 top
R16  34.34,14.7 0 top
R17  6.84,25.7 0 top
R18  15.84,25.7 180 top
R19  6.84,34.7 270 top
R20  54.34,28.2 90 top
R21  54.34,31.7 270 top
R22  44.84,15.7 90 top
R23  44.84,11.7 90 top
R301  58.21,37.42 180 top
R302  58.21,40.71 180 top
S2  63.15,12.8 270 top
U1  34.33,28.22 270 top
U3  11.58,16.61 90 top
U4  11.9,31.08 0 top
U$2  34.34,55.7 90 top

### Tracks (layer width: path | path; a pad name or v marks a point on that pad's centre or on a via)
+3V3  (via drill 0.5, 1.1)
  Top 0.254: U$2.9/VCC 37.64,50.5 37.34,50.2 37.34,42.7 37.55,42.5 U$2.1/VCC_IO | U4.13 13.21,29.83 12.84,30.2 11.34,30.2 | U4.3 10.71,31.33 10.84,31.2 10.84,30.7 11.34,30.2 | U4.8 11.15,30.01 11.34,30.2 | R301.2 57.36,35.72 v57.34,35.7 57.34,33.7 56.19,32.55 R21.1 | R14.2 v20.84,37.7 20.7,37.55 R2.2 R1.2
  Top 0.305: U4.3 7.98,31.33 v7.84,31.2 7.7,31.05 C1.1 | U3.2 U3.3 10.13,14.41 10.84,13.7 14.34,13.7 15.49,14.85 R10.2 | R9.2 15.84,20.2 15.34,20.7 9.34,20.7 8.84,21.2
  Top 0.406: U3.2 9.26,16.61 8.34,15.7 6.99,15.7 C5.1
  Top 0.61: U$2.9/VCC 40.14,50.5 40.84,51.2 43.2,51.2 C2.1 | C7.1 v35.84,36.7 | U3.2 9.93,16.61 8.84,17.7 8.84,21.2 v8.84,22.7
  Top 1.016: v48.34,49.2 45.5,49.2 C2.1
  Bottom 0.254: v57.34,35.7 55.34,35.7 | v20.84,37.7 20.84,39.2
  Bottom 0.305: v7.84,31.2 8.84,31.2
  Bottom 0.61: U1.A1 37.68,36.7 | 37.68,36.7 37.68,39.03 37.84,39.2 | 37.84,39.2 55.34,39.2 | 37.84,39.2 20.84,39.2 10.84,39.2 8.84,37.2 8.84,31.2 v8.84,22.7 | v35.84,36.7 37.68,36.7
  Bottom 1.016: JP3.P1 56.81,5.23 55.34,6.7 55.34,35.7 55.34,39.2 55.34,47.2 53.34,49.2 v48.34,49.2
+5V
  Top 0.254: Q1.1 48.04,23.89 | Q1.2 49.31,24.16 48.84,23.7 | Q1.3 50.58,23.93 50.34,23.7
  Top 0.61: Q2.5 47.94,9.6 48.84,9.2 | Q2.6 49.21,9.33 49.84,9.2 | Q2.7 50.48,9.56 51.34,9.2 | Q2.8 51.75,9.29 52.34,8.7 | 47.84,23.7 48.04,23.89 48.65,23.89 48.84,23.7
  Top 1.016: 51.34,9.2 49.84,9.2 48.84,9.2 41.34,9.2 40.34,10.2 40.34,22.2 41.84,23.7 47.84,23.7 48.84,23.7 50.34,23.7 | JP3.P4 JP3.P2 57.9,2.36 58.75,3.1 58.75,9.1
  Top 1.27: S2.3 59.84,10.3 58.75,9.1 58.25,8.7 52.34,8.7 51.34,9.2
CO2_AD  (via drill 0.5)
  Top 0.254: R16.1 33.34,14.85 C6.1 27.84,12.35 v27.84,10.7 | JP3.P40 7.19,2.36 6.34,3.2 6.34,9.7 9.34,12.7 16.84,12.7 v18.84,10.7
  Bottom 0.254: v18.84,10.7 v27.84,10.7
GND  (via drill 0.5, 0.6)
  other vias: 43.34,10.7 31.84,50.2 35.84,50.2 31.84,46.7 41.84,54.2 48.34,54.2 52.34,54.2 55.84,54.2 58.34,50.7 62.84,34.2 62.84,30.7 53.84,13.2 42.34,20.7 51.34,20.7 56.84,23.7 2.34,7.7 2.34,14.2 2.34,20.2 2.34,26.2 2.34,32.7 2.34,39.7 2.34,46.2 20.84,53.7 26.84,53.7 20.34,31.7 19.34,22.7 11.84,19.7 27.84,19.2 37.34,12.2 39.84,28.7 27.84,28.7 27.84,37.7 48.34,42.7
  pour Bottom: -1.16,58.7 67.84,58.7 68.34,58.2 68.34,-1.3 67.84,-1.8 -2.16,-1.8 -2.16,57.7
  pour Top: -0.66,57.7 66.84,57.7 66.84,-0.8 66.34,-1.3 -0.66,-1.3 -1.16,-0.8 -1.16,57.2
GPS_RESET
  Top 0.254: U$2.23/RESET_N 22.64,45.5 20.84,43.7 R14.1 21.7,41.55 22.05,41.2 22.05,39.5 24.84,36.7 24.84,10.2 28.34,6.7 37.34,6.7 37.84,6.2 37.84,3.55 JP3.P16
GPS_RXD
  Top 0.254: R3.2 25.84,10.7 28.84,7.7 37.84,7.7 38.84,6.7 45.14,6.7 45.84,6 47.55,6 47.84,5.7 47.84,3.71 JP3.P8
GPS_TIMEPULSE  (via drill 0.5)
  Top 0.254: v43.34,35.7 43.34,39.7 42.84,40.2 34.84,40.2 34.34,40.7 U$2.29/TIMEPULSE
  Bottom 0.254: JP3.P15 39.03,9.89 44.34,15.2 44.34,34.7 v43.34,35.7
GPS_TXD
  Top 0.254: R4.2 23.34,39.2 25.34,37.2 25.34,10.5 28.64,7.2 37.55,7.2 38.55,6.2 44.84,6.2 45.34,5.7 45.34,3.67 JP3.P10
HEATER_ENABLE  (via drill 0.5)
  Top 0.254: v48.34,28.2 53.5,28.2 R20.2
  Top 0.61: R20.2 R21.2
  Bottom 0.254: JP3.P7 48.65,4.9 46.34,7.2 46.34,26.2 v48.34,28.2
I2CA_SCL  (via drill 0.5)
  Top 0.254: U4.23 11.15,34.01 11.84,34.7 13.34,34.7 13.84,35.2 | 13.84,35.2 R1.1 | 13.84,35.2 23.34,35.2 24.34,34.2 24.34,9.2 v26.34,7.2 | v48.84,7.2 46.84,7.2 46.34,7.7 39.84,7.7 38.84,8.7 31.34,8.7 v30.84,9.2
  Bottom 0.254: v48.84,7.2 49.43,7.2 JP3.P5 | v26.34,7.2 28.84,7.2 v30.84,9.2
I2CA_SDA  (via drill 0.5)
  Top 0.254: R2.1 10.84,34.7 10.65,34.51 U4.24 10.65,33.89 10.34,34.2 v9.84,34.2 | v51.84,7.2 51.34,7.2 50.34,8.2 40.34,8.2 39.34,9.2 32.34,9.2 v30.84,10.7 | v18.34,34.2 18.84,34.2 19.34,34.7 22.84,34.7 23.84,33.7 23.84,8.2 v24.34,7.7
  Bottom 0.254: JP3.P3 54.15,4.9 v51.84,7.2 | v9.84,34.2 v18.34,34.2 | v24.34,7.7 24.84,8.2 28.34,8.2 v30.84,10.7
I2CB_SCL
  Top 0.254: JP3.P28 22.89,2.36 22.55,2.7 22.55,5.5 20.84,7.2 20.84,12.7
  Top 0.305: U3.5 15.28,16.61 R10.1 19.49,16.55 20.84,15.2 20.84,12.7
I2CB_SDA
  Top 0.254: 21.34,15.7 21.34,7.7 23.8,5.25 JP3.P27
  Top 0.305: 21.34,15.7 18.7,18.35 R9.1 15.61,18.11 U3.6
IMU_INT  (via drill 0.5)
  Top 0.254: U4.12 22.46,29.08 23.34,28.2 23.34,8.7 v22.84,8.2
  Bottom 0.254: v22.84,8.2 22.84,7.7 24.34,6.2 36.84,6.2 37.84,5.2 37.84,4.2 38.34,3.7 40.84,3.7 41.34,4.2 41.34,4.67 JP3.P13
KEEP_ALIVE  (via drill 0.5, 0.6)
  Top 0.254: R11.2 v42.34,11.7 | R12.2 56.28,44.13 55.84,43.7 55.84,41.7 55.34,41.2 45.34,41.2 44.84,40.7 v44.84,36.7
  Bottom 0.254: JP3.P12 42.84,3.63 42.84,6.2 40.84,8.2 40.84,10.7 41.84,11.7 v42.34,11.7 44.84,14.2 v44.84,36.7
N$1
  Top 0.254: U4.10 12.15,26.89 12.34,26.7 12.34,25.85 C3.1
N$2  (via drill 0.7)
  Top 0.61: U$2.8/V_BCKP 41.55,49.5 v41.84,49.2
  Bottom 0.61: B2.+2 18.95,45.1 20.34,43.7 41.34,43.7 42.34,44.7 42.34,48.7 v41.84,49.2
N$3
  Top 0.254: U$2.26/RXD 26.14,42.5 25.84,42.2 R3.1
N$4
  Top 0.254: U$2.25/TXD 24.14,43.5 23.34,42.7 R4.1
N$5
  Top 0.254: R16.2 R15.2 35.2,20.55 37.68,23.03 U1.B1
N$6
  Top 0.61: U$2.16/ANT 28.64,52.5 28.34,52.2 28.34,51.7 28.55,51.5 U$2.17/RF_IN
N$7
  Top 0.254: R22.2 44.84,17.2 45.84,18.2 49.84,18.2
  Top 0.61: Q2.1 51.75,18.11 | 51.75,18.11 51.84,18.2 | Q2.2 50.48,17.84 | 50.48,17.84 50.84,18.2 51.66,18.2 51.75,18.11 | Q2.3 49.21,18.06 49.34,18.2 49.84,18.2 | 50.48,17.84 50.48,18.06 50.34,18.2
  Top 1.016: JP4.1 58.84,21.2 57.34,19.7 57.34,18.2 | 57.34,18.2 57.34,13.7 58.25,12.8 S2.2 | 57.34,18.2 50.84,18.2 50.34,18.2 49.84,18.2
N$8
  Top 0.254: U4.20 12.65,34.01 12.84,34.2 16.34,34.2 16.84,33.7 C4.1
N$9
  Top 0.254: Q2.4 47.94,14.79 46.84,13.7 44.84,13.7 | 44.84,13.7 R22.1 42.55,14.85 R11.1 | R23.2 44.84,13.7
N$10  (via drill 0.5)
  Top 0.254: S2.1 60.4,16.64 v59.84,17.2 | v57.34,7.2 56.34,6.2 48.34,6.2 47.84,6.7 46.34,6.7 45.84,7.2 39.34,7.2 38.34,8.2 29.84,8.2 v28.34,9.7 | v19.84,9.7 15.34,9.7 14.84,9.2 R5.2
  Bottom 0.254: v59.84,17.2 59.84,9.7 v57.34,7.2 | v28.34,9.7 v19.84,9.7
N$11
  Top 0.254: U4.9 11.65,27.51 11.34,27.2 8.34,27.2 7.84,26.7 7.84,25.85 R17.2
N$12
  Top 0.254: U4.11 12.65,27.89 13.34,27.2 14.34,27.2 14.84,26.7 14.84,25.85 R18.2
N$13
  Top 0.254: U4.1 7.21,32.33 6.84,32.7 R19.2
N$14
  Top 0.61: Q1.6 50.58,33.47 49.84,34.2 | Q1.5 51.85,33.2 50.84,34.2 | Q1.7 49.31,33.74 48.84,34.2 | Q1.8 48.04,33.51 47.34,34.2
  Top 1.016: U1.HA 34.33,33.68 34.84,34.2 47.34,34.2 48.84,34.2 49.84,34.2 50.84,34.2
N$16
  Top 0.61: R20.1 52.5,27.35 51.84,26.7 Q1.4
N$18  (via drill 0.5)
  other vias: 40.84,46.7
SWITCH_MONITOR
  Top 0.254: JP3.P37 11.09,8.95 11.34,9.2 R5.1 R6.2
USER_LED0  (via drill 0.5)
  Top 0.254: R302.2 46.86,40.71 46.36,40.71 45.84,40.2 v45.84,35.7
  Bottom 0.254: v45.84,35.7 45.84,6.63 JP3.P11
VDD_PGOOD1
  Top 0.254: LED301.A R301.1
VDD_PGOOD2
  Top 0.254: LED302.A R302.1
VDD_PGOOD3
  Top 0.254: LED1.A R12.1

### Text on the board
tPlace: ALIVE | Y | LED0 | X | PWR | GND | +5V